# EAGLE design motherboard (EAGLE 6.5.0)
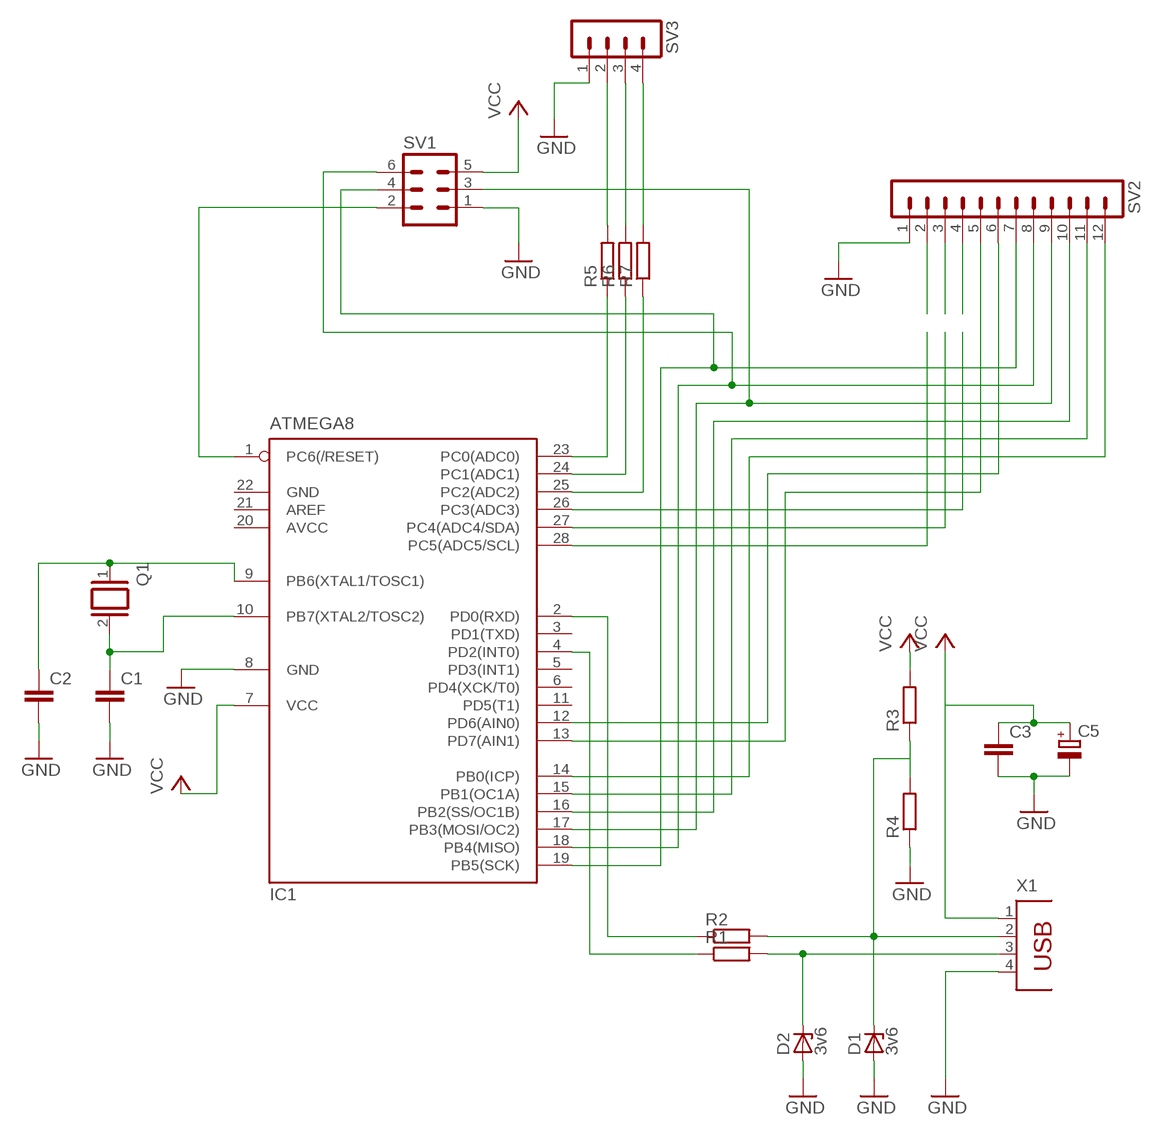
[diagram p0: schematic, sheet 1]

## Parts
C1  C-EU050-024X044  [C050-024X044]
C2  C-EU050-024X044  [C050-024X044]
C3  C-EU050-024X044  [C050-024X044]
C5  CPOL-EUB45181B  [B45181B]
D1  3v6  ZENER-DIODEDO35Z10  [DO35Z10]
D2  3v6  ZENER-DIODEDO35Z10  [DO35Z10]
IC1  ATMEGA8  MEGA8-P  [DIL28-3]
Q1  XTAL  [Q]
R1  R-EU_0207/7  [0207/7]
R2  R-EU_0207/7  [0207/7]
R3  R-EU_0207/7  [0207/7]
R4  R-EU_0207/7  [0207/7]
R5  R-EU_0204/7  [0204/7]
R6  R-EU_0204/7  [0204/7]
R7  R-EU_0204/7  [0204/7]
SV1  MA03-2  [MA03-2]
SV2  MA12-1  [MA12-1]
SV3  MA04-1  [MA04-1]
X1  PN87520  [PN87520]

## Nets
GND: C1.2 C2.2 C3.2 C5.- D1.A D2.A IC1.8(GND) R4.1 SV1.1 SV2.1 SV3.1 X1.4
N$1: D1.C R2.2 R3.1 R4.2 X1.2
N$2: D2.C R1.2 X1.3
N$3: IC1.4(PD2(INT0)) R1.1
N$4: IC1.2(PD0(RXD)) R2.1
N$5: C1.1 IC1.10(PB7(XTAL2/TOSC2)) Q1.2
N$6: C2.1 IC1.9(PB6(XTAL1/TOSC1)) Q1.1
N$7: IC1.19(PB5(SCK)) SV1.4 SV2.7
N$8: IC1.14(PB0(ICP)) SV2.12
N$9: R5.2 SV3.2
N$10: IC1.17(PB3(MOSI/OC2)) SV1.3 SV2.9
N$11: IC1.16(PB2(SS/OC1B)) SV2.10
N$12: IC1.15(PB1(OC1A)) SV2.11
N$13: IC1.12(PD6(AIN0)) SV2.6
N$14: IC1.13(PD7(AIN1)) SV2.5
N$15: IC1.26(PC3(ADC3))
N$16: IC1.27(PC4(ADC4/SDA))
N$17: IC1.28(PC5(ADC5/SCL))
N$18: IC1.1(PC6(/RESET)) SV1.2
N$19: R6.2 SV3.3
N$20: IC1.25(PC2(ADC2)) R7.1
N$21: IC1.24(PC1(ADC1)) R6.1
N$22: IC1.23(PC0(ADC0)) R5.1
N$23: IC1.18(PB4(MISO)) SV1.6 SV2.8
N$24: R7.2 SV3.4
N$25: SV2.2
N$26: SV2.3
N$27: SV2.4
VCC: C3.1 C5.+ IC1.7(VCC) R3.2 SV1.5 X1.1
Unconnected: IC1.3(PD1(TXD)) IC1.5(PD3(INT1)) IC1.6(PD4(XCK/T0)) IC1.11(PD5(T1)) IC1.21(AREF)

## Power pins joined to a net without a drawn wire
AVCC: IC1.20(AVCC)
GND: IC1.22(GND)

## Library data of the parts
C1-C3 = rcl:C-EU: CAPACITOR, European symbol
C5 = rcl:CPOL-EU: POLARIZED CAPACITOR, European symbol
D1 D2 = diode:ZENER-DIODE: Z-Diode
IC1 = atmel:MEGA8-P: MICROCONTROLLER 8 Kbytes FLASH, 1 kbytes SRAM, 512 bytes EEPROM, USART, 4-channel 10 bit ADC, 2-channel 8 bit ADC Pin compatible with Atmega48, ATMega88, ATMega168 Source: avr.lbr; OC_FARNELL: unknown; OC_NEWARK: unknown
Q1 = special:XTAL: CRYSTAL
R1-R7 = resistor:R-EU_: RESISTOR, European symbol
SV1 = con-lstb:MA03-2: PIN HEADER; OC_FARNELL: unknown; OC_NEWARK: unknown
SV2 = con-lstb:MA12-1: PIN HEADER; OC_FARNELL: unknown; OC_NEWARK: unknown
SV3 = con-lstb:MA04-1: PIN HEADER; OC_FARNELL: unknown; OC_NEWARK: unknown
X1 = con-berg:PN87520: BERG USB connector; OC_FARNELL: unknown; OC_NEWARK: unknown

## Net classes
0 default: width 0.406 mm, drill 0.508 mm, clearance 0.254 mm

## Board
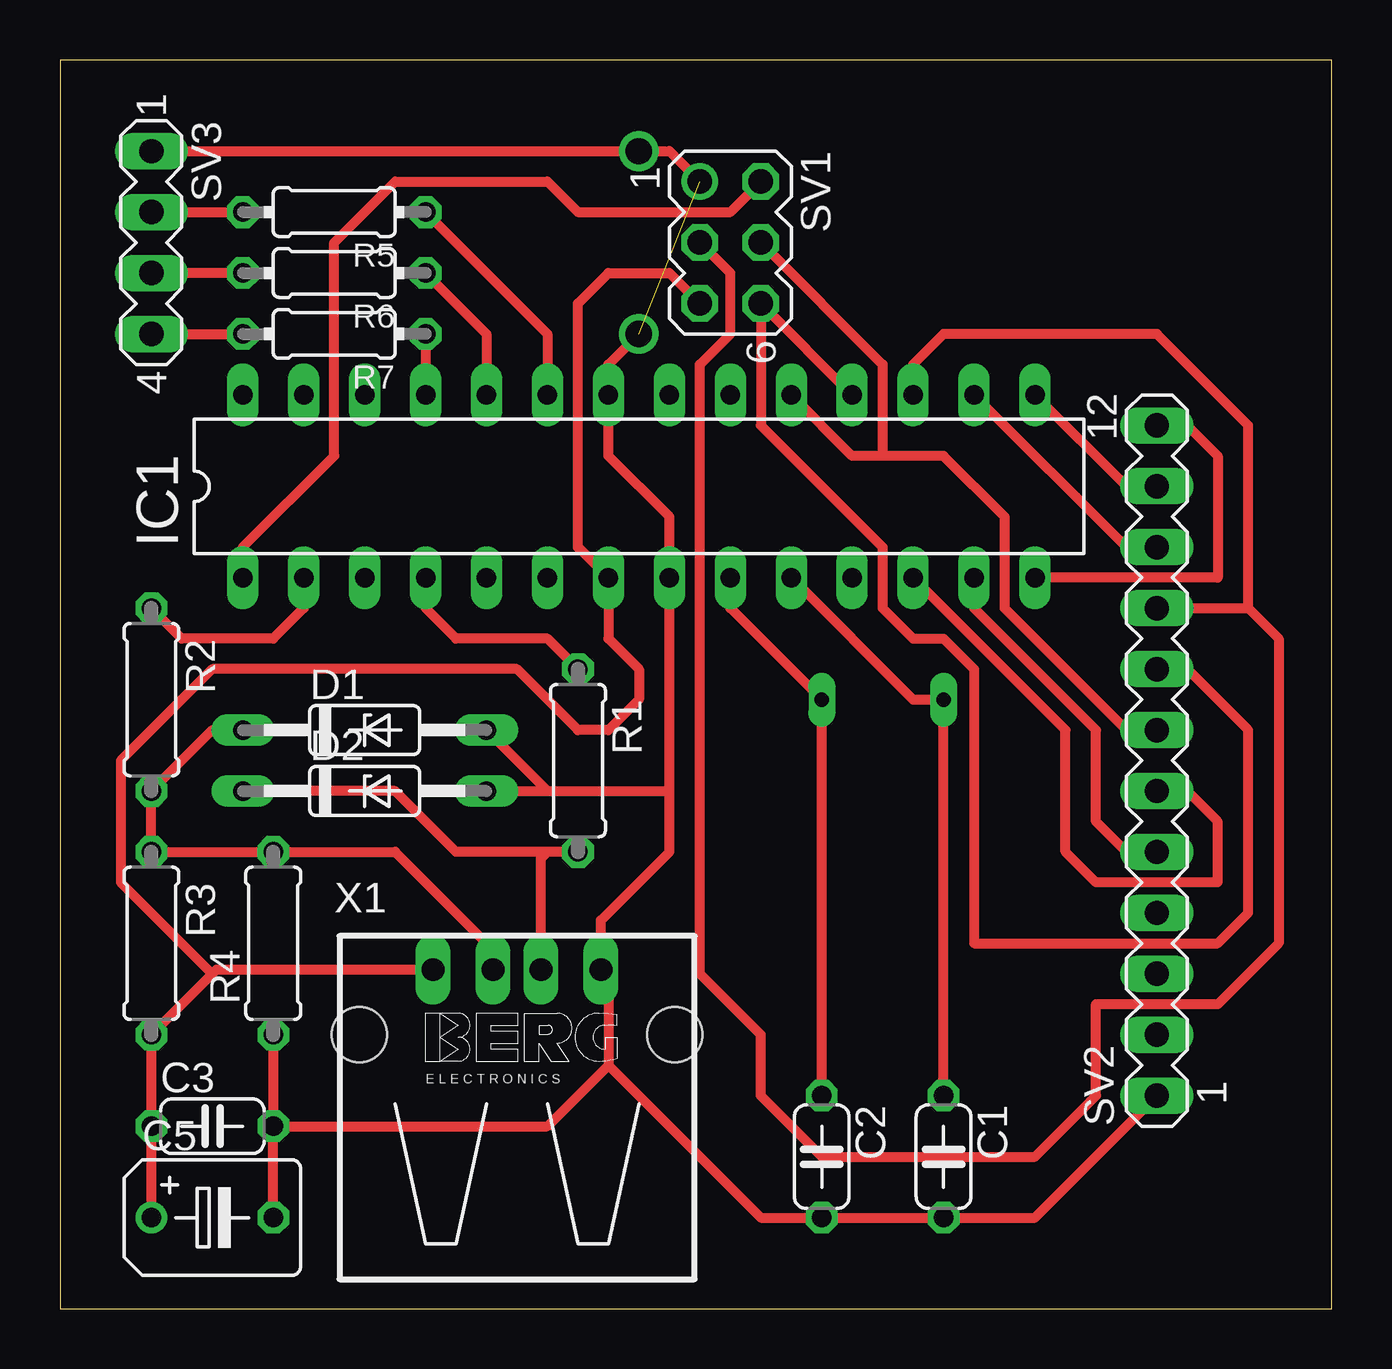
[diagram p1: board, top side]
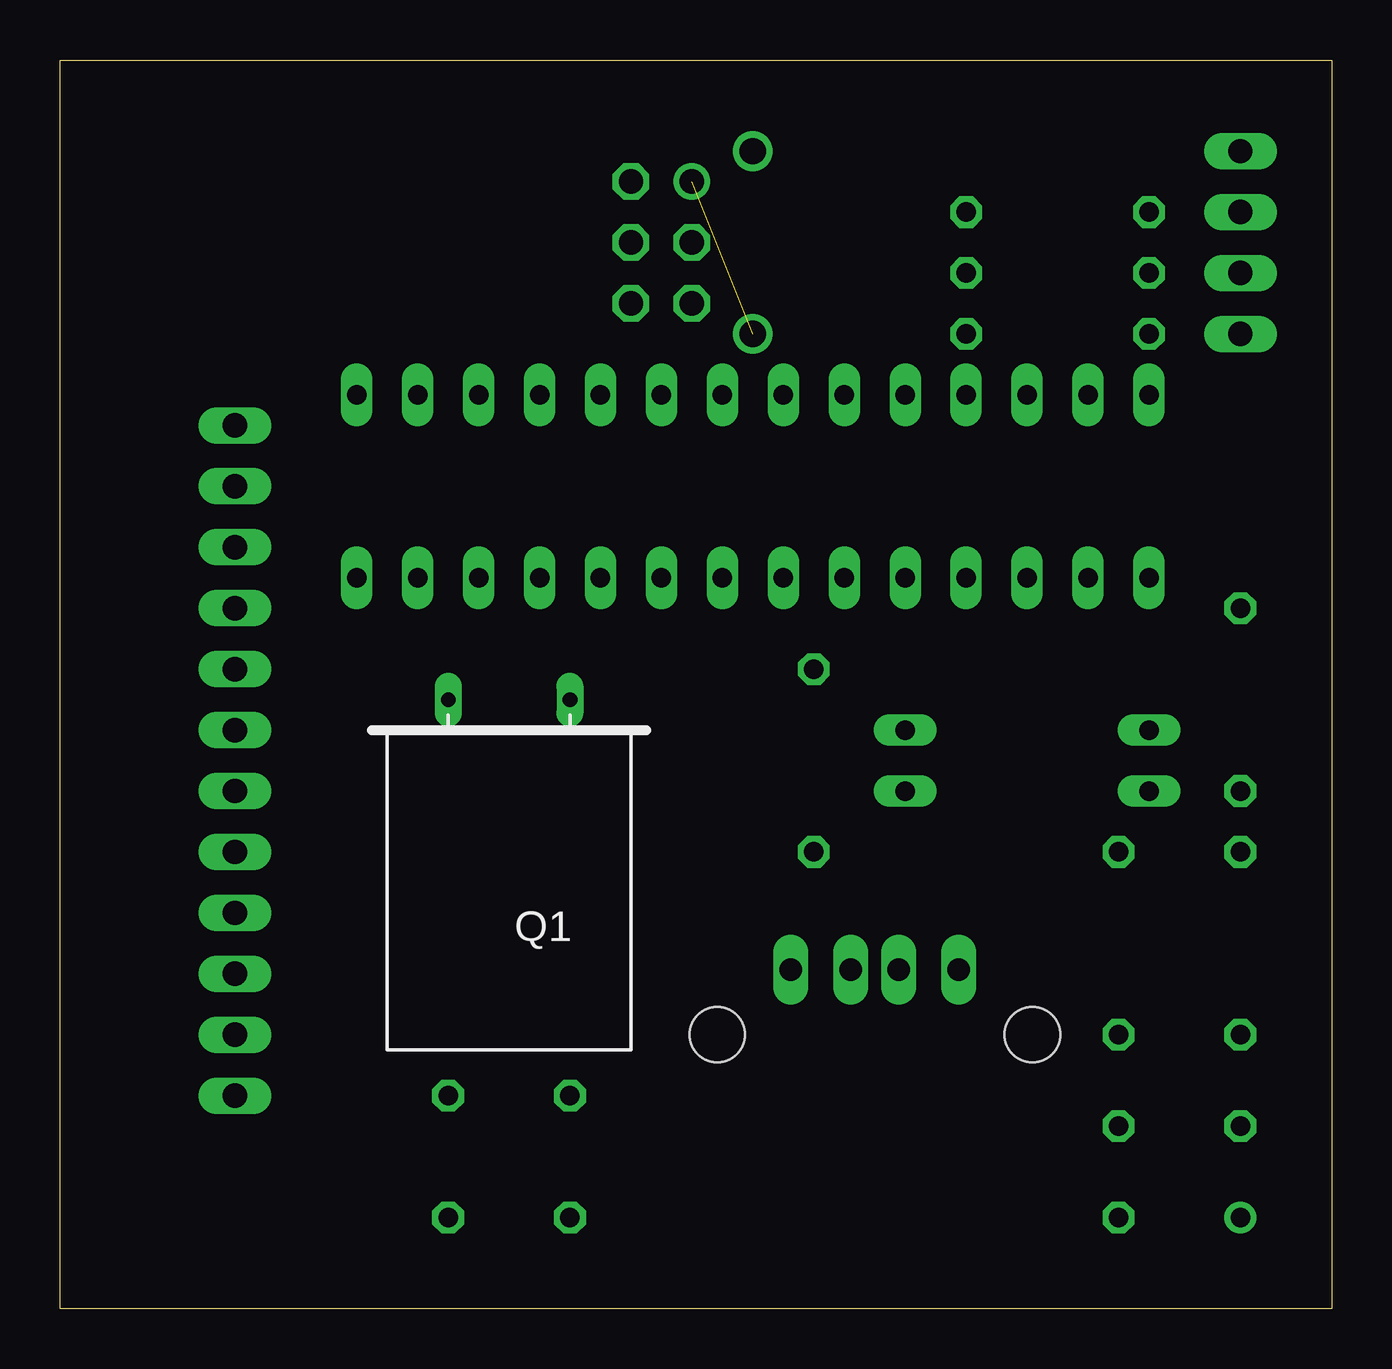
[diagram p2: board, bottom side, seen from below]

Size 53.01 x 52.06 mm. Coordinates in mm from the lower left corner, seen from the top.
Outline: 0,0 53.01,0 53.01,52.06 0,52.06 0,0
Copper layers (1*16): Top 0.035mm / dielectric 1.5mm / Bottom 0.035mm
Design rules "default *": minimum track width 10mil, minimum drill 24mil, track to track 16mil, track to pad 16mil, pad to pad 16mil, via to via 16mil, smd to smd 16mil, copper to edge 40mil, drill to drill 8mil, minimum pad ring 10mil, minimum via ring 8mil, stop-mask expansion 4mil, vias tented up to drill 0mil, thermal gap 10mil

### Footprints (pad centres in the part's own frame; a part is rotated, then mirrored left to right if it is on the bottom)
C050-024X044 = drill 0.813 octagon: 1 -2.54,0; 2 2.54,0
B45181B = drill 0.813: + -2.54,0 | drill 0.813 octagon: - 2.54,0
DO35Z10 = drill 0.813 long: A 5.08,0; C -5.08,0
DIL28-3 = drill 0.813 long: 1 -16.51,-3.81; 2 -13.97,-3.81; 3 -11.43,-3.81; 4 -8.89,-3.81; 5 -6.35,-3.81; 6 -3.81,-3.81; 7 -1.27,-3.81; 8 1.27,-3.81; 9 3.81,-3.81; 10 6.35,-3.81; 11 8.89,-3.81; 12 11.43,-3.81; 13 13.97,-3.81; 14 16.51,-3.81; 15 16.51,3.81; 16 13.97,3.81; 17 11.43,3.81; 18 8.89,3.81; 19 6.35,3.81; 20 3.81,3.81; 21 1.27,3.81; 22 -1.27,3.81; 23 -3.81,3.81; 24 -6.35,3.81; 25 -8.89,3.81; 26 -11.43,3.81; 27 -13.97,3.81; 28 -16.51,3.81
Q = drill 0.61 long: 1 -2.54,-7.62; 2 2.54,-7.62
0207/7 = drill 0.813 octagon: 1 -3.81,0; 2 3.81,0
0204/7 = drill 0.813 octagon: 1 -3.81,0; 2 3.81,0
MA03-2 = drill 1.016: 1 -2.54,-1.27 | drill 1.016 octagon: 2 -2.54,1.27; 3 0,-1.27; 4 0,1.27; 5 2.54,-1.27; 6 2.54,1.27
MA12-1 = drill 1.016 long: 1 -13.97,0; 2 -11.43,0; 3 -8.89,0; 4 -6.35,0; 5 -3.81,0; 6 -1.27,0; 7 1.27,0; 8 3.81,0; 9 6.35,0; 10 8.89,0; 11 11.43,0; 12 13.97,0
MA04-1 = drill 1.016 long: 1 -3.81,0; 2 -1.27,0; 3 1.27,0; 4 3.81,0
PN87520 = drill 0.95 long: 1 -3.5,2.71; 2 -1,2.71; 3 1,2.71; 4 3.5,2.71 | hole 2.3: -6.57,0; 6.57,0

### Placement (x,y rotation side)
C1  36.83,6.35 270 top
C2  31.75,6.35 270 top
C3  6.35,7.62 0 top
C5  6.35,3.81 0 top
D1  12.7,24.13 0 top
D2  12.7,21.59 0 top
IC1  24.13,34.29 0 top
Q1  34.29,17.78 180 bottom
R1  21.59,22.86 270 top
R2  3.81,25.4 270 top
R3  3.81,15.24 270 top
R4  8.89,15.24 90 top
R5  11.43,45.72 180 top
R6  11.43,43.18 180 top
R7  11.43,40.64 180 top
SV1  27.94,44.45 270 top
SV2  45.72,22.86 90 top
SV3  3.81,44.45 270 top
X1  19.05,11.43 0 top

### Tracks (layer width: path | path; a pad name or v marks a point on that pad's centre or on a via)
GND  (1 unrouted)
  Top 0.406: C5.- C3.2 | 25.4,21.59 25.4,19.05 22.55,16.2 X1.4 22.86,13.83 22.86,10.16 | 25.4,21.59 IC1.8 25.4,33.02 22.86,35.56 IC1.22 22.86,39.37 24.13,40.64 | D1.A 20.32,21.59 | 20.32,21.59 25.4,21.59 | D2.A 20.32,21.59 | SV2.1 40.64,3.81 C1.2 C2.2 29.21,3.81 22.86,10.16 | SV3.1 25.4,48.26 SV1.1 | R4.1 C3.2 | C3.2 20.32,7.62 22.86,10.16
N$1
  Top 0.406: X1.2 17.78,15.24 13.97,19.05 R4.2 R3.1 R2.2 6.35,24.13 D1.C
N$2
  Top 0.406: R1.2 20.32,19.05 | 20.32,19.05 16.51,19.05 13.97,21.59 D2.C | X1.3 20.05,18.78 20.32,19.05
N$3
  Top 0.406: R1.1 20.32,27.94 16.51,27.94 15.24,29.21 IC1.4
N$4
  Top 0.406: IC1.2 10.16,29.21 8.89,27.94 5.08,27.94 R2.1
N$5
  Top 0.406: C1.1 Q1.2 35.56,25.4 IC1.10
N$6
  Top 0.406: C2.1 Q1.1 27.94,29.21 IC1.9
N$7
  Top 0.406: IC1.19 33.02,35.56 34.29,35.56 | 34.29,35.56 34.29,39.37 SV1.4 | 34.29,35.56 36.83,35.56 39.37,33.02 39.37,29.21 44.45,24.13 SV2.7
N$8
  Top 0.406: IC1.14 48.26,30.48 48.26,35.56 46.99,36.83 SV2.12
N$9
  Top 0.406: SV3.2 R5.2
N$10
  Top 0.406: SV2.9 49.53,29.21 | 49.53,29.21 49.53,36.83 45.72,40.64 36.83,40.64 35.56,39.37 IC1.17 | SV1.3 27.94,43.18 27.94,40.64 26.67,39.37 26.67,13.97 29.21,11.43 29.21,8.89 31.75,6.35 40.64,6.35 43.18,8.89 43.18,12.7 48.26,12.7 50.8,15.24 50.8,27.94 49.53,29.21
N$11
  Top 0.406: IC1.16 44.45,31.75 SV2.10
N$12
  Top 0.406: IC1.15 44.45,34.29 SV2.11
N$13
  Top 0.406: IC1.12 41.91,24.13 41.91,19.05 43.18,17.78 48.26,17.78 48.26,20.32 46.99,21.59 SV2.6
N$14
  Top 0.406: IC1.13 38.1,29.21 43.18,24.13 43.18,20.32 44.45,19.05 SV2.5
N$18
  Top 0.406: IC1.1 7.62,31.75 11.43,35.56 11.43,44.45 13.97,46.99 20.32,46.99 21.59,45.72 27.94,45.72 SV1.2
N$19
  Top 0.406: R6.2 SV3.3
N$20
  Top 0.406: R7.1 IC1.25
N$21
  Top 0.406: R6.1 17.78,40.64 IC1.24
N$22
  Top 0.406: R5.1 20.32,40.64 IC1.23
N$23
  Top 0.406: IC1.18 SV1.6 29.21,36.83 34.29,31.75 34.29,29.21 35.56,27.94 36.83,27.94 38.1,26.67 38.1,15.24 48.26,15.24 49.53,16.51 49.53,24.13 46.99,26.67 SV2.8
N$24
  Top 0.406: SV3.4 R7.2
N$30  (via drill 1.1)
  other vias: 24.13,40.64
N$31  (via drill 1.1)
  other vias: 24.13,48.26
VCC
  Top 0.406: C5.+ C3.1 R3.2 6.35,13.97 | X1.1 6.52,14.14 6.35,13.97 | 6.35,13.97 2.54,17.78 2.54,22.86 6.35,26.67 19.05,26.67 21.59,24.13 22.86,24.13 24.13,25.4 24.13,26.67 22.86,27.94 IC1.7 21.59,31.75 21.59,41.91 22.86,43.18 25.4,43.18 SV1.5